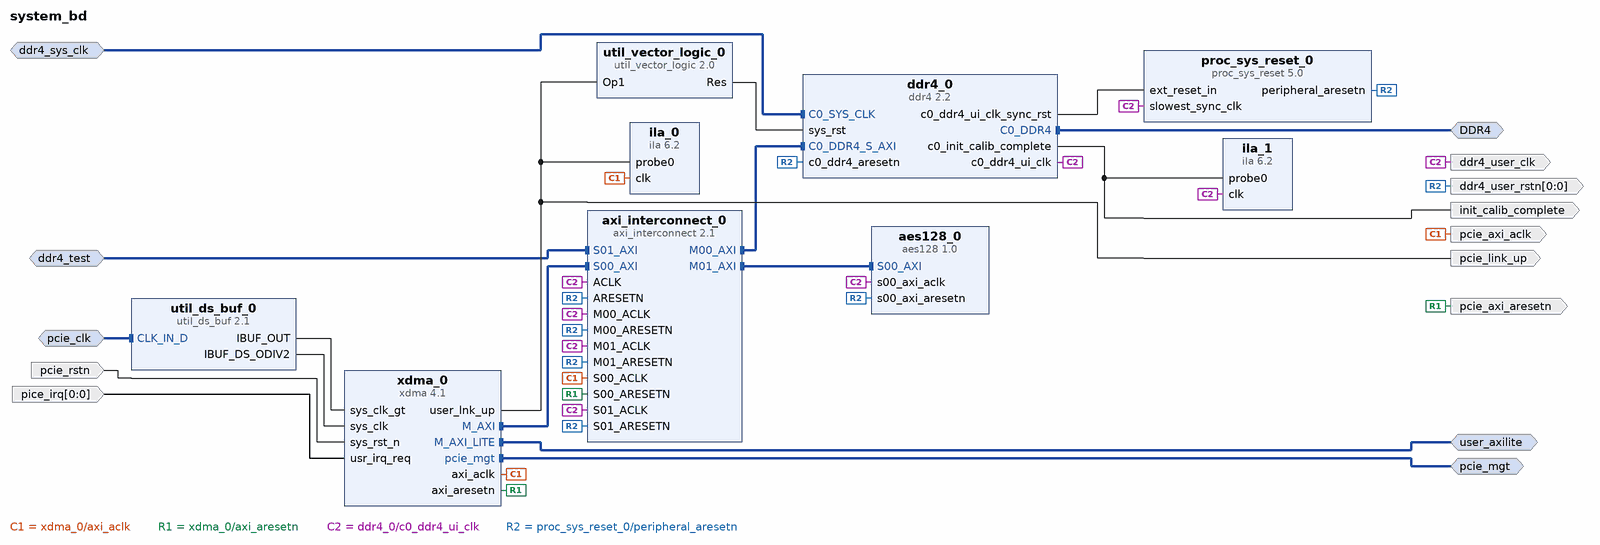
[diagram p0: block diagram of the top level]
# Vivado block design system_bd, xcku060-ffva1156-2-i, Vivado 2019.2
create_bd_design system_bd

create_bd_intf_port -mode Master -vlnv xilinx.com:interface:aximm_rtl:1.0 user_axilite
set_property -dict [list \
  CONFIG.DATA_WIDTH 32 \
  CONFIG.PROTOCOL AXI4LITE \
  CONFIG.FREQ_HZ 250000000 \
  CONFIG.ADDR_WIDTH 32 \
  CONFIG.HAS_BURST 0 \
  CONFIG.HAS_LOCK 0 \
  CONFIG.HAS_CACHE 0 \
  CONFIG.HAS_QOS 0 \
  CONFIG.HAS_REGION 0 \
] [get_bd_intf_ports user_axilite]
create_bd_intf_port -mode Master -vlnv xilinx.com:interface:ddr4_rtl:1.0 DDR4
create_bd_intf_port -mode Slave -vlnv xilinx.com:interface:aximm_rtl:1.0 ddr4_test
set_property -dict [list \
  CONFIG.DATA_WIDTH 32 \
  CONFIG.PROTOCOL AXI4 \
  CONFIG.FREQ_HZ 250000000 \
  CONFIG.ID_WIDTH 0 \
  CONFIG.ADDR_WIDTH 32 \
  CONFIG.AWUSER_WIDTH 0 \
  CONFIG.ARUSER_WIDTH 0 \
  CONFIG.WUSER_WIDTH 0 \
  CONFIG.RUSER_WIDTH 0 \
  CONFIG.BUSER_WIDTH 0 \
  CONFIG.READ_WRITE_MODE READ_WRITE \
  CONFIG.HAS_BURST 1 \
  CONFIG.HAS_LOCK 1 \
  CONFIG.HAS_PROT 1 \
  CONFIG.HAS_CACHE 1 \
  CONFIG.HAS_QOS 1 \
  CONFIG.HAS_REGION 0 \
  CONFIG.HAS_WSTRB 1 \
  CONFIG.HAS_BRESP 1 \
  CONFIG.HAS_RRESP 1 \
  CONFIG.SUPPORTS_NARROW_BURST 1 \
  CONFIG.NUM_READ_OUTSTANDING 2 \
  CONFIG.NUM_WRITE_OUTSTANDING 2 \
  CONFIG.MAX_BURST_LENGTH 256 \
  CONFIG.NUM_READ_THREADS 1 \
  CONFIG.NUM_WRITE_THREADS 1 \
  CONFIG.RUSER_BITS_PER_BYTE 0 \
  CONFIG.WUSER_BITS_PER_BYTE 0 \
] [get_bd_intf_ports ddr4_test]
create_bd_intf_port -mode Master -vlnv xilinx.com:interface:pcie_7x_mgt_rtl:1.0 pcie_mgt
create_bd_intf_port -mode Slave -vlnv xilinx.com:interface:diff_clock_rtl:1.0 pcie_clk
create_bd_intf_port -mode Slave -vlnv xilinx.com:interface:diff_clock_rtl:1.0 ddr4_sys_clk
set_property -dict {CONFIG.FREQ_HZ 100000000} [get_bd_intf_ports ddr4_sys_clk]
create_bd_port -dir O -type clk pcie_axi_aclk
set_property -dict {CONFIG.ASSOCIATED_RESET pcie_axi_aresetn CONFIG.FREQ_HZ 250000000} [get_bd_ports pcie_axi_aclk]
create_bd_port -dir O -type rst pcie_axi_aresetn
create_bd_port -dir O -type clk ddr4_user_clk
set_property -dict [list \
  CONFIG.ASSOCIATED_BUSIF ddr4_test \
  CONFIG.ASSOCIATED_RESET ddr4_user_rstn \
  CONFIG.FREQ_HZ 250000000 \
] [get_bd_ports ddr4_user_clk]
create_bd_port -dir O init_calib_complete
create_bd_port -dir O -from 0 -to 0 -type rst ddr4_user_rstn
create_bd_port -dir O pcie_link_up
create_bd_port -dir I -type rst pcie_rstn
create_bd_port -dir I -from 0 -to 0 pice_irq

create_bd_cell -type ip -vlnv xilinx.com:ip:xdma:4.1 xdma_0
set_property -dict [list \
  CONFIG.PF0_DEVICE_ID_mqdma 9038 \
  CONFIG.PF2_DEVICE_ID_mqdma 9038 \
  CONFIG.PF3_DEVICE_ID_mqdma 9038 \
  CONFIG.axi_data_width 256_bit \
  CONFIG.axilite_master_en true \
  CONFIG.axisten_freq 250 \
  CONFIG.cfg_mgmt_if false \
  CONFIG.pf0_device_id 8038 \
  CONFIG.pf0_interrupt_pin NONE \
  CONFIG.pf0_link_status_slot_clock_config true \
  CONFIG.pl_link_cap_max_link_speed 8.0_GT/s \
  CONFIG.pl_link_cap_max_link_width X8 \
  CONFIG.plltype QPLL1 \
  CONFIG.xdma_rnum_chnl 1 \
  CONFIG.xdma_wnum_chnl 1 \
] [get_bd_cells xdma_0]
create_bd_cell -type ip -vlnv xilinx.com:ip:ddr4:2.2 ddr4_0
set_property -dict [list \
  CONFIG.C0.BANK_GROUP_WIDTH 1 \
  CONFIG.C0.DDR4_AxiAddressWidth 32 \
  CONFIG.C0.DDR4_AxiDataWidth 512 \
  CONFIG.C0.DDR4_CasLatency 16 \
  CONFIG.C0.DDR4_CasWriteLatency 11 \
  CONFIG.C0.DDR4_DataWidth 64 \
  CONFIG.C0.DDR4_InputClockPeriod 10000 \
  CONFIG.C0.DDR4_MemoryPart MT40A512M16HA-083E \
  CONFIG.C0.DDR4_TimePeriod 1000 \
] [get_bd_cells ddr4_0]
create_bd_cell -type ip -vlnv xilinx.com:ip:proc_sys_reset:5.0 proc_sys_reset_0
create_bd_cell -type ip -vlnv xilinx.com:ip:axi_interconnect:2.1 axi_interconnect_0
set_property -dict [list \
  CONFIG.M00_HAS_DATA_FIFO 2 \
  CONFIG.NUM_MI 2 \
  CONFIG.NUM_SI 2 \
  CONFIG.S00_HAS_DATA_FIFO 2 \
  CONFIG.S01_HAS_DATA_FIFO 2 \
] [get_bd_cells axi_interconnect_0]
create_bd_cell -type ip -vlnv xilinx.com:ip:util_vector_logic:2.0 util_vector_logic_0
set_property -dict {CONFIG.C_OPERATION not CONFIG.C_SIZE 1} [get_bd_cells util_vector_logic_0]
create_bd_cell -type ip -vlnv xilinx.com:ip:util_ds_buf:2.1 util_ds_buf_0
set_property -dict {CONFIG.C_BUF_TYPE IBUFDSGTE} [get_bd_cells util_ds_buf_0]
create_bd_cell -type ip -vlnv xilinx.com:ip:ila:6.2 ila_0
set_property -dict [list \
  CONFIG.C_ENABLE_ILA_AXI_MON false \
  CONFIG.C_INPUT_PIPE_STAGES 4 \
  CONFIG.C_MONITOR_TYPE Native \
  CONFIG.C_NUM_OF_PROBES 1 \
] [get_bd_cells ila_0]
create_bd_cell -type ip -vlnv xilinx.com:ip:ila:6.2 ila_1
set_property -dict [list \
  CONFIG.C_ENABLE_ILA_AXI_MON false \
  CONFIG.C_INPUT_PIPE_STAGES 4 \
  CONFIG.C_MONITOR_TYPE Native \
  CONFIG.C_NUM_OF_PROBES 1 \
] [get_bd_cells ila_1]
create_bd_cell -type ip -vlnv xilinx.com:user:aes128:1.0 aes128_0

# ---- connections ----

connect_bd_intf_net [get_bd_intf_ports user_axilite] [get_bd_intf_pins xdma_0/M_AXI_LITE]
connect_bd_intf_net -intf_net diff_clock_rtl_0_1 [get_bd_intf_ports ddr4_sys_clk] [get_bd_intf_pins ddr4_0/C0_SYS_CLK]
connect_bd_intf_net -intf_net CLK_IN_D_0_1 [get_bd_intf_ports pcie_clk] [get_bd_intf_pins util_ds_buf_0/CLK_IN_D]
connect_bd_intf_net [get_bd_intf_ports DDR4] [get_bd_intf_pins ddr4_0/C0_DDR4]
connect_bd_intf_net [get_bd_intf_ports pcie_mgt] [get_bd_intf_pins xdma_0/pcie_mgt]
connect_bd_intf_net [get_bd_intf_pins axi_interconnect_0/M00_AXI] [get_bd_intf_pins ddr4_0/C0_DDR4_S_AXI]
connect_bd_intf_net -intf_net S01_AXI_0_1 [get_bd_intf_ports ddr4_test] [get_bd_intf_pins axi_interconnect_0/S01_AXI]
connect_bd_intf_net [get_bd_intf_pins xdma_0/M_AXI] [get_bd_intf_pins axi_interconnect_0/S00_AXI]
connect_bd_intf_net [get_bd_intf_pins axi_interconnect_0/M01_AXI] [get_bd_intf_pins aes128_0/S00_AXI]
connect_bd_net [get_bd_pins xdma_0/axi_aclk] [get_bd_ports pcie_axi_aclk] [get_bd_pins axi_interconnect_0/S00_ACLK] [get_bd_pins ila_0/clk]
connect_bd_net [get_bd_pins xdma_0/axi_aresetn] [get_bd_ports pcie_axi_aresetn] [get_bd_pins axi_interconnect_0/S00_ARESETN]
connect_bd_net [get_bd_pins ddr4_0/c0_ddr4_ui_clk] \
  [get_bd_ports ddr4_user_clk] [get_bd_pins proc_sys_reset_0/slowest_sync_clk] [get_bd_pins axi_interconnect_0/ACLK] \
  [get_bd_pins axi_interconnect_0/M00_ACLK] [get_bd_pins axi_interconnect_0/S01_ACLK] [get_bd_pins ila_1/clk] \
  [get_bd_pins aes128_0/s00_axi_aclk] [get_bd_pins axi_interconnect_0/M01_ACLK]
connect_bd_net [get_bd_pins ddr4_0/c0_init_calib_complete] [get_bd_ports init_calib_complete] [get_bd_pins ila_1/probe0]
connect_bd_net [get_bd_pins ddr4_0/c0_ddr4_ui_clk_sync_rst] [get_bd_pins proc_sys_reset_0/ext_reset_in]
connect_bd_net [get_bd_pins proc_sys_reset_0/peripheral_aresetn] \
  [get_bd_ports ddr4_user_rstn] [get_bd_pins axi_interconnect_0/ARESETN] [get_bd_pins axi_interconnect_0/M00_ARESETN] \
  [get_bd_pins axi_interconnect_0/S01_ARESETN] [get_bd_pins ddr4_0/c0_ddr4_aresetn] [get_bd_pins aes128_0/s00_axi_aresetn] \
  [get_bd_pins axi_interconnect_0/M01_ARESETN]
connect_bd_net [get_bd_pins xdma_0/user_lnk_up] [get_bd_ports pcie_link_up] [get_bd_pins ila_0/probe0] [get_bd_pins util_vector_logic_0/Op1]
connect_bd_net [get_bd_pins util_vector_logic_0/Res] [get_bd_pins ddr4_0/sys_rst]
connect_bd_net -net sys_rst_n_0_1 [get_bd_ports pcie_rstn] [get_bd_pins xdma_0/sys_rst_n]
connect_bd_net [get_bd_pins util_ds_buf_0/IBUF_OUT] [get_bd_pins xdma_0/sys_clk_gt]
connect_bd_net [get_bd_pins util_ds_buf_0/IBUF_DS_ODIV2] [get_bd_pins xdma_0/sys_clk]
connect_bd_net -net usr_irq_req_0_1 [get_bd_ports pice_irq] [get_bd_pins xdma_0/usr_irq_req]

# ---- address map ----
assign_bd_address -offset 0x00000000 -range 4G -target_address_space [get_bd_addr_spaces ddr4_test] [get_bd_addr_segs ddr4_0/C0_DDR4_MEMORY_MAP/C0_DDR4_ADDRESS_BLOCK]
assign_bd_address -offset 0x44A00000 -range 64K -target_address_space [get_bd_addr_spaces ddr4_test] [get_bd_addr_segs aes128_0/S00_AXI/S00_AXI_reg]
assign_bd_address -offset 0x0000000000000000 -range 4G -target_address_space [get_bd_addr_spaces xdma_0/M_AXI] [get_bd_addr_segs ddr4_0/C0_DDR4_MEMORY_MAP/C0_DDR4_ADDRESS_BLOCK]
assign_bd_address -offset 0x0000000044A00000 -range 64K -target_address_space [get_bd_addr_spaces xdma_0/M_AXI] [get_bd_addr_segs aes128_0/S00_AXI/S00_AXI_reg]
assign_bd_address -offset 0x00000000 -range 64K -target_address_space [get_bd_addr_spaces xdma_0/M_AXI_LITE] [get_bd_addr_segs user_axilite/Reg]

validate_bd_design
save_bd_design
